# EAGLE design Restaurant-RFID-System (EAGLE 9.6.1)
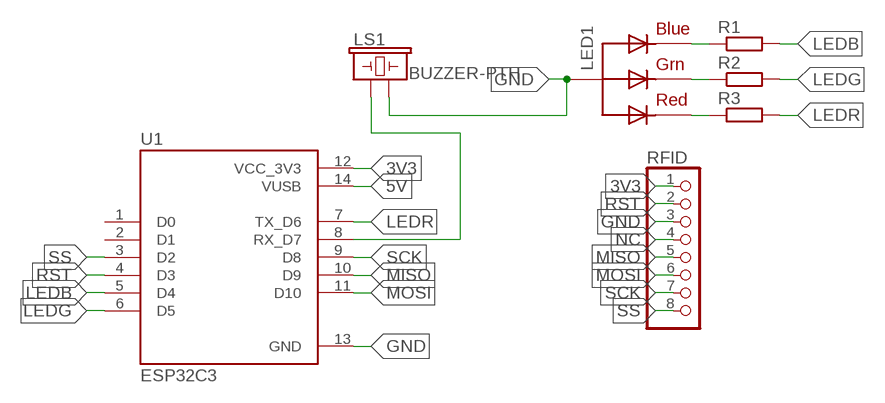
[diagram p0: schematic, sheet 1]

## Parts
LED1  RGBLED_CA-5MM  [LED5MMRGB]
LS1  BUZZER-PTH  [BUZZER-12MM]
R1  R-EU_R0805  [R0805]
R2  R-EU_R0805  [R0805]
R3  R-EU_R0805  [R0805]
RFID  PINHD-1X8  [1X08]
U1  ESP32C3  113991054  [MODULE_113991054]

## Nets
3V3: RFID.1 U1.12(VCC_3V3)
5V: U1.14(VUSB)
GND: LED1.2(VCC) LS1.- RFID.3 U1.13(GND)
LEDB: R1.2 U1.5(D4)
LEDG: R2.2 U1.6(D5)
LEDR: R3.2 U1.7(TX_D6)
MISO: RFID.5 U1.10(D9)
MOSI: RFID.6 U1.11(D10)
N$1: LED1.4(BLUE) R1.1
N$2: LED1.3(GREEN) R2.1
N$3: LED1.1(RED) R3.1
N$4: LS1.+ U1.8(RX_D7)
NC: RFID.4
RST: RFID.2 U1.4(D3)
SCK: RFID.7 U1.9(D8)
SS: RFID.8 U1.3(D2)
Unconnected: U1.1(D0) U1.2(D1)

## Library data of the parts
LED1 = adafruit:RGBLED_CA: RGB LED, common-anode 5MM Staggered pins 5mm Piranha package http://www.ladyada.net/library/pcb/eaglelibrary.html
LS1 = SparkFun-Electromechanical:BUZZER: Buzzer Small round buzzers that operate around the audible 2kHz range. You can use these as speakers to create simple music or user interfaces. Variant Overview: PTH - Mini Speaker - PC Mount 12mm 2.048kHz <https://www.sparkfun.com/products/7950> PTH_KIT - Mini Speaker - PC Mount 12mm 2.048kHz <https://www.sparkfun.com/products/7950> KIT simplifies soldering by adding stop mask to one side of the pads. PTH_NO_SILK - Mini Speaker - PC Mount 12mm 2.048kHz <https://www.sparkfun.com/products/7950> No silkscreen indicator of buzzer outline. PTH_KIT_NO_SILK - Mini Speaker - PC Mount 12mm 2.048kHz <https://www.sparkfun.com/products/7950> KIT package w/o silkscreen SMD - Buzzer Audio Magnetic (CCV-084B16) SMD buzzer used on, e.g. the LilyPad Buzzer <https://www.sparkfun.com/products/8463> and RFID USB Reader <https://www.sparkfun.com/products/9963>. SMD_KIT - Buzzer Audio Magnetic (CCV-084B16) SMD Buzzer with elongated pins to make soldering easier. Used on the SparkFun Simon Says - Surface Mount Soldering Kit <https://www.sparkfun.com/products/10935>. SMD-SQUARE - Buzzer Audio Magnetic (COMP-15701) SMT square buzzer with one chamfered corner.; PROD_ID: COMP-08253; SF_SKU: COM-07950
R1-R3 = rcl:R-EU_: RESISTOR, European symbol; SPICEPREFIX: R
RFID = pinhead:PINHD-1X8: PIN HEADER
U1 = ESP32C3:113991054; CHECK_PRICES: https://www.snapeda.com/parts/113991054/Seeed+Technology+Co.%252C+Ltd/view-part/?ref=eda; DESCRIPTION: - ESP32-C3 Transceiver; 802.11 a/b/g/n (Wi-Fi, WiFi, WLAN), Bluetooth® Smart 4.x Low Energy (BLE) 2.4GHz Evaluation Board; MF: Seeed Technology Co., Ltd; MP: 113991054; PACKAGE: None; PURCHASE-URL: https://www.snapeda.com/api/url_track_click_mouser/?unipart_id=12200757&manufacturer=Seeed Technology Co., Ltd&part_name=113991054&search_term=None; SNAPEDA_LINK: https://www.snapeda.com/parts/113991054/Seeed+Technology+Co.%252C+Ltd/view-part/?ref=snap

## Board
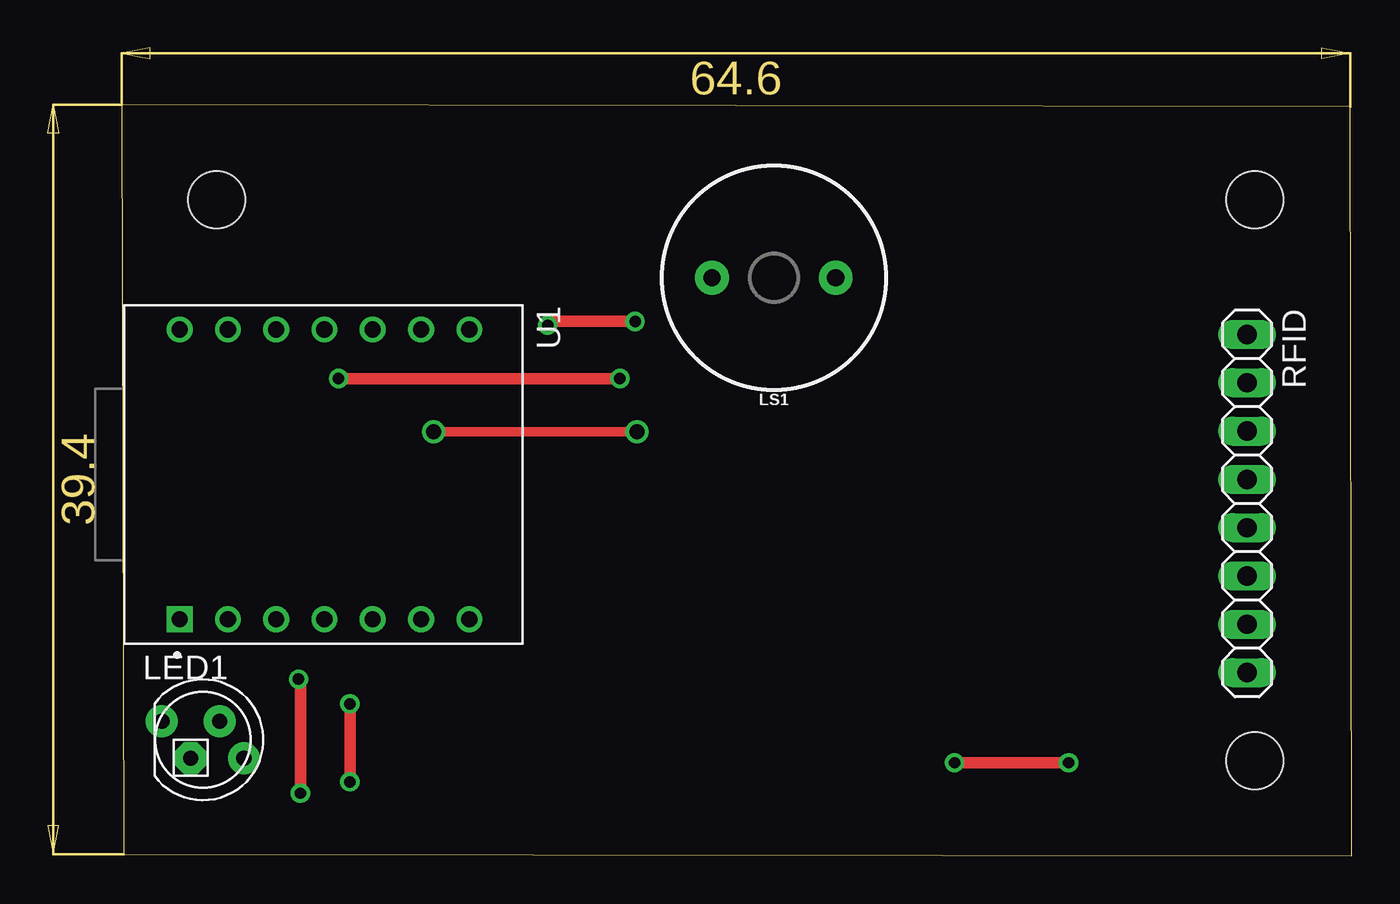
[diagram p1: board, top side]
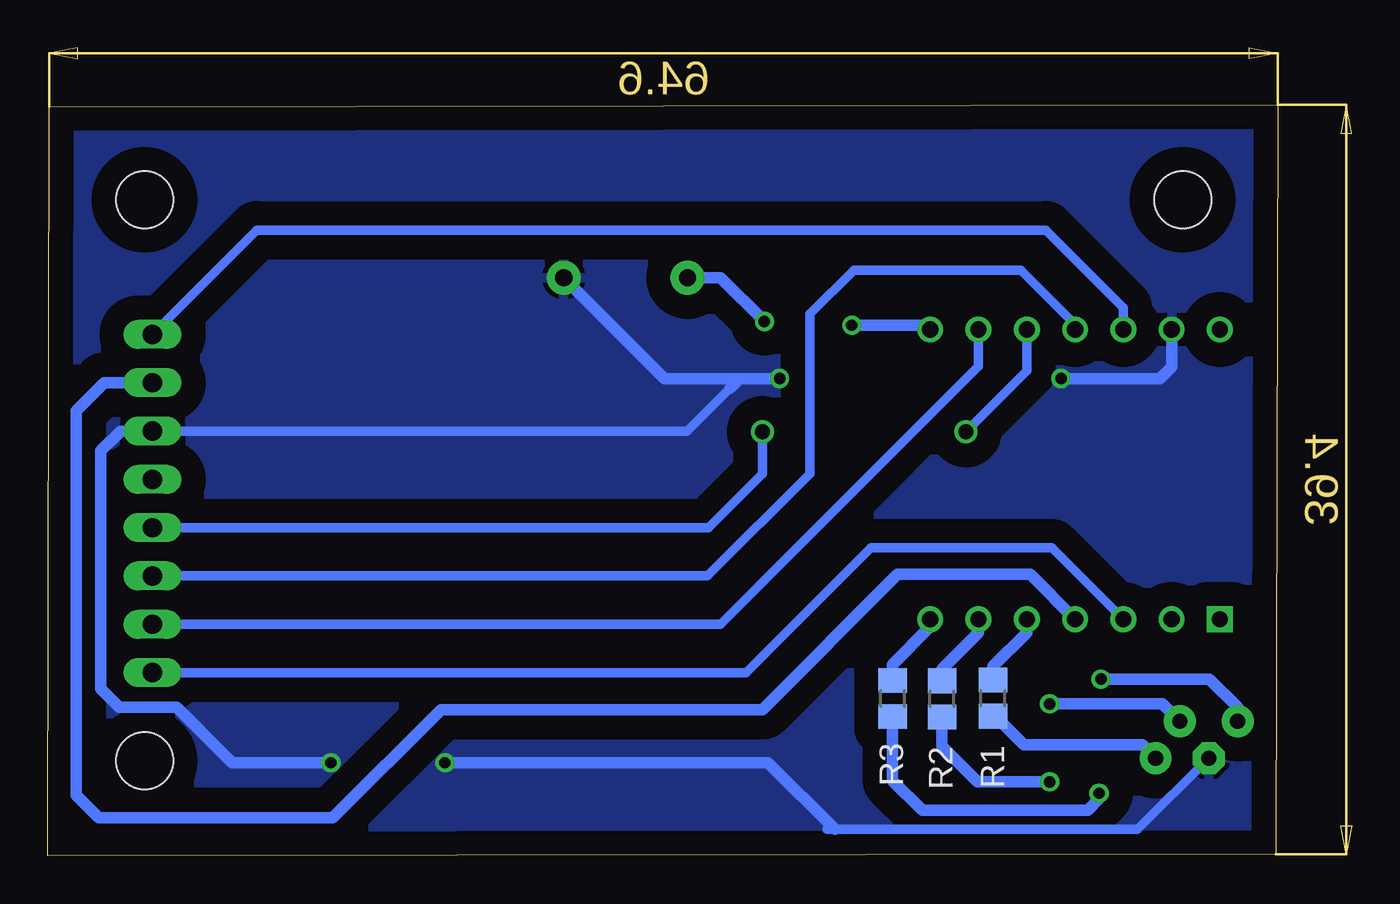
[diagram p2: board, bottom side, seen from below]

Size 64.7 x 39.5 mm. Coordinates in mm from the lower left corner, seen from the top.
Outline: 0.1,0.1 64.7,0 64.6,39.4 0,39.5 0.1,0.1
Copper layers (1*16): Top 0.035mm / dielectric 1.5mm / Bottom 0.035mm
Design rules "default": minimum track width 6mil, minimum drill 0.35mm, track to track 6mil, track to pad 6mil, pad to pad 6mil, via to via 6mil, smd to smd 6mil, copper to edge 40mil, drill to drill 6mil, minimum pad ring 10mil, minimum via ring 8mil, stop-mask expansion 4mil, vias tented up to drill 0mil, thermal gap 10mil
Holes 3 mm at 59.6,34.5 59.6,5 5,34.5

### Footprints (pad centres in the part's own frame; a part is rotated, then mirrored left to right if it is on the bottom)
LED5MMRGB = drill 0.8 pad 1.676: 1 -2.159,0.968; 3 0.889,0.968; 4 2.159,-0.968 | drill 0.8 pad 1.676 octagon: 2 -0.635,-0.968
BUZZER-12MM = drill 0.9 pad 1.778: + 3.25,0; - -3.25,0
R0805 = smd 1.3 x 1.5: 1 -0.95,0; 2 0.95,0
1X08 = drill 1.016 long: 1 -8.89,0; 2 -6.35,0; 3 -3.81,0; 4 -1.27,0; 5 1.27,0; 6 3.81,0; 7 6.35,0; 8 8.89,0
MODULE_113991054 = drill 0.85 square: 1 -7.62,7.556 | drill 0.85: 2 -7.62,5.016; 3 -7.62,2.477; 4 -7.62,-0.064; 5 -7.62,-2.603; 6 -7.62,-5.144; 7 -7.62,-7.684; 8 7.62,-7.684; 9 7.62,-5.144; 10 7.62,-2.603; 11 7.62,-0.064; 12 7.62,2.477; 13 7.62,5.016; 14 7.62,7.556

### Placement (x,y rotation side)
LED1  4.27,6.11 0 top
LS1  34.3,30.4 180 top
R1  14.98,8.3 90 bottom
R2  17.66,8.26 90 bottom
R3  20.26,8.28 90 bottom
RFID  59.18,18.53 270 top
U1  10.6,20.06 90 top

### Tracks (layer width: path | path; a pad name or v marks a point on that pad's centre or on a via)
3V3
  Bottom 0.508: RFID.1 53.7,32.9 12.2,32.9 8.12,28.82 U1.12
GND  (via drill 0.6 pad 0.8)
  Top 0.61: v26.2,25.1 v11.4,25.1 | v43.8,4.9 v49.8,4.9
  Bottom 0.508: RFID.3 58.9,22.34 31.06,22.34 28.8,24.6 | LED1.2 7.38,1.4 23.3,1.4 23.7,1.4
  Bottom 0.61: 28.8,24.6 28.3,25.1 | 28.3,25.1 v26.2,25.1 | v11.4,25.1 6.2,25.1 5.58,25.72 U1.13 | 23.3,1.4 26.8,4.9 v43.8,4.9 | v49.8,4.9 55,4.9 57.92,7.82 60.92,7.82 61.9,8.8 61.9,21.3 60.86,22.34 58.9,22.34 | LS1.- 32.25,25.1 28.3,25.1
  pour Bottom (isolate 1.27): 0,39.5 63.43,39.5 64.7,38.23 64.7,0 1.27,0 0,1.27
LEDB
  Bottom 0.61: R1.2 14.98,9.96 13.2,11.74 U1.5
LEDG
  Bottom 0.61: R2.2 17.66,9.82 15.74,11.74 U1.6
LEDR
  Bottom 0.61: R3.2 20.26,10.06 18.28,12.04 U1.7
MISO  (via drill 0.8 pad 0.6)
  Top 0.508: v27.1,22.3 v16.4,22.3
  Bottom 0.508: RFID.5 29.94,17.26 27.1,20.1 v27.1,22.3 | v16.4,22.3 13.2,25.5 U1.10
MOSI
  Bottom 0.508: RFID.6 29.98,14.72 24.6,20.1 24.6,28.5 22.3,30.8 13.5,30.8 10.66,27.96 U1.11
N$1
  Bottom 0.61: LED1.4 7.13,5.84 13.34,5.84 14.85,7.35 R1.1
N$2  (via drill 0.6 pad 0.8)
  Top 0.61: v12,8 v12,3.9
  Bottom 0.61: LED1.3 6.08,8 v12,8 | v12,3.9 15.8,3.9 17.66,5.76 R2.1
N$3  (via drill 0.6 pad 0.8)
  Top 0.61: v9.4,3.3 9.4,9.2 v9.3,9.3
  Bottom 0.61: R3.1 20.26,3.96 18.7,2.4 10,2.4 9.4,3 v9.4,3.3 | v9.3,9.3 3.6,9.3 2.11,7.81 LED1.1
N$4  (via drill 0.6 pad 0.8)
  Top 0.61: v22.4,27.9 22.6,28.1 v27,28.1
  Bottom 0.61: U1.8 18.5,27.9 v22.4,27.9 | v27,28.1 29.3,30.4 LS1.+
RST
  Bottom 0.61: U1.4 13.02,14.8 20,14.8 27.1,7.7 44,7.7 49.7,2 62,2 63.2,3.2 63.2,23.4 61.72,24.88 RFID.2
SCK
  Bottom 0.508: RFID.7 29.32,12.18 15.74,25.76 U1.9
SS
  Bottom 0.508: RFID.8 27.96,9.64 21.4,16.2 11.88,16.2 U1.3